# EAGLE design old_control_board (EAGLE 7.7.0)
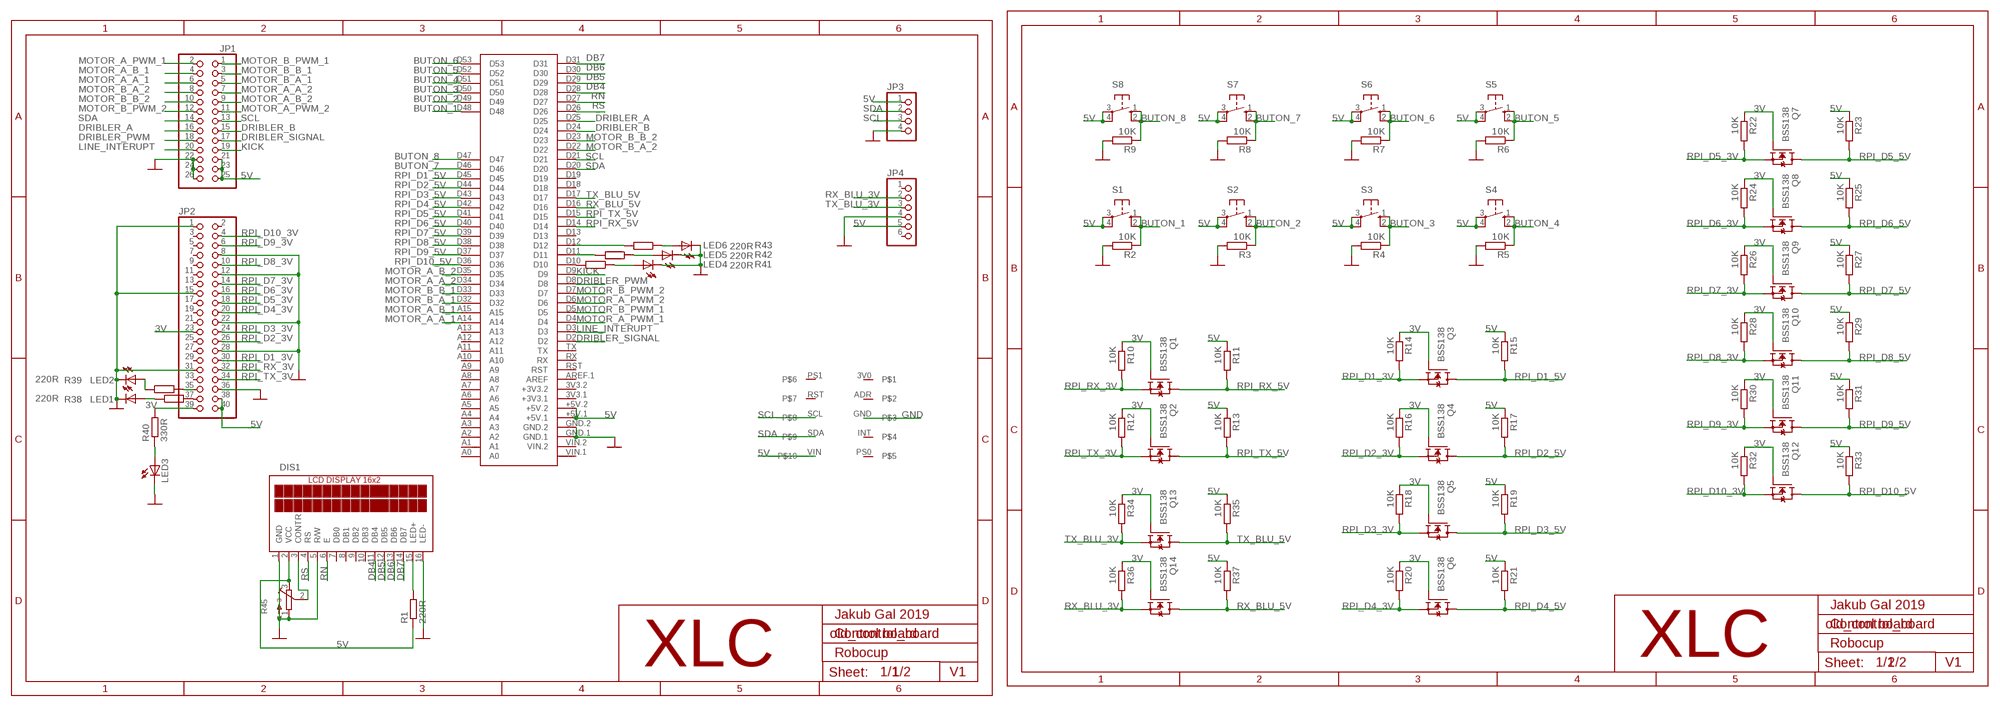
[diagram p0: schematic, sheet 1]

## Parts
DIS1  LCD_DISPLEJ_16X2Z  [LCD_DISPLEJ_16X2]
JP1  PINHD-2X13_2.54  [2X13]
JP2  PINHD-2X20_2.54  [2X20]
JP3  PINHD-1X4_2.54  [1X04]
JP4  PINHD-1X6_2.54  [1X06]
LED1  LEDCHIPLED_0603  [CHIPLED_0603]
LED2  LEDCHIPLED_0603  [CHIPLED_0603]
LED3  LEDCHIPLED_0603  [CHIPLED_0603]
LED4  LEDCHIPLED_0603  [CHIPLED_0603]
LED5  LEDCHIPLED_0603  [CHIPLED_0603]
LED6  LEDCHIPLED_0603  [CHIPLED_0603]
Q1  BSS138  [SOT23]
Q2  BSS138  [SOT23]
Q3  BSS138  [SOT23]
Q4  BSS138  [SOT23]
Q5  BSS138  [SOT23]
Q6  BSS138  [SOT23]
Q7  BSS138  [SOT23]
Q8  BSS138  [SOT23]
Q9  BSS138  [SOT23]
Q10  BSS138  [SOT23]
Q11  BSS138  [SOT23]
Q12  BSS138  [SOT23]
Q13  BSS138  [SOT23]
Q14  BSS138  [SOT23]
R1  220R  R-EU_R0603  [R0603]
R2  10K  R-EU_R0603  [R0603]
R3  10K  R-EU_R0603  [R0603]
R4  10K  R-EU_R0603  [R0603]
R5  10K  R-EU_R0603  [R0603]
R6  10K  R-EU_R0603  [R0603]
R7  10K  R-EU_R0603  [R0603]
R8  10K  R-EU_R0603  [R0603]
R9  10K  R-EU_R0603  [R0603]
R10  10K  R-EU_R0603  [R0603]
R11  10K  R-EU_R0603  [R0603]
R12  10K  R-EU_R0603  [R0603]
R13  10K  R-EU_R0603  [R0603]
R14  10K  R-EU_R0603  [R0603]
R15  10K  R-EU_R0603  [R0603]
R16  10K  R-EU_R0603  [R0603]
R17  10K  R-EU_R0603  [R0603]
R18  10K  R-EU_R0603  [R0603]
R19  10K  R-EU_R0603  [R0603]
R20  10K  R-EU_R0603  [R0603]
R21  10K  R-EU_R0603  [R0603]
R22  10K  R-EU_R0603  [R0603]
R23  10K  R-EU_R0603  [R0603]
R24  10K  R-EU_R0603  [R0603]
R25  10K  R-EU_R0603  [R0603]
R26  10K  R-EU_R0603  [R0603]
R27  10K  R-EU_R0603  [R0603]
R28  10K  R-EU_R0603  [R0603]
R29  10K  R-EU_R0603  [R0603]
R30  10K  R-EU_R0603  [R0603]
R31  10K  R-EU_R0603  [R0603]
R32  10K  R-EU_R0603  [R0603]
R33  10K  R-EU_R0603  [R0603]
R34  10K  R-EU_R0603  [R0603]
R35  10K  R-EU_R0603  [R0603]
R36  10K  R-EU_R0603  [R0603]
R37  10K  R-EU_R0603  [R0603]
R38  220R  R-EU_R0603  [R0603]
R39  220R  R-EU_R0603  [R0603]
R40  330R  R-EU_R0603  [R0603]
R41  220R  R-EU_R0603  [R0603]
R42  220R  R-EU_R0603  [R0603]
R43  220R  R-EU_R0603  [R0603]
R45  3362P  [3362P]
S1  10-XX  [B3F-10XX]
S2  10-XX  [B3F-10XX]
S3  10-XX  [B3F-10XX]
S4  10-XX  [B3F-10XX]
S5  10-XX  [B3F-10XX]
S6  10-XX  [B3F-10XX]
S7  10-XX  [B3F-10XX]
S8  10-XX  [B3F-10XX]
U$1  MEGA2560_MIKRO  [MEGA2560_MIKRO]
U$2  BNO055  [BNO005]

## Nets
3V: JP2.23 JP2.39 Q1.1(G) Q2.1(G) Q3.1(G) Q4.1(G) Q5.1(G) Q6.1(G) Q7.1(G) Q8.1(G) Q9.1(G) Q10.1(G) Q11.1(G) Q12.1(G) Q13.1(G) Q14.1(G) R10.1 R12.1 R14.1 R16.1 R18.1 R20.1 R22.1 R24.1 R26.1 R28.1 R30.1 R32.1 R34.1 R36.1 R40.2
5V: DIS1.2(VCC) JP1.21 JP1.23 JP1.25 JP2.38 JP2.40 JP3.1 JP4.5 R1.1 R11.1 R13.1 R15.1 R17.1 R19.1 R21.1 R23.1 R25.1 R27.1 R29.1 R31.1 R33.1 R35.1 R37.1 R45.3 S1.3(P) S1.4(P1) S2.3(P) S2.4(P1) S3.3(P) S3.4(P1) S4.3(P) S4.4(P1) S5.3(P) S5.4(P1) S6.3(P) S6.4(P1) S7.3(P) S7.4(P1) S8.3(P) S8.4(P1) U$1.+5V.1 U$1.+5V.2 U$2.VIN
BUTON_1: R2.1 S1.1(S) S1.2(S1) U$1.D48
BUTON_2: R3.1 S2.1(S) S2.2(S1) U$1.D49
BUTON_3: R4.1 S3.1(S) S3.2(S1) U$1.D50
BUTON_4: R5.1 S4.1(S) S4.2(S1) U$1.D51
BUTON_5: R6.1 S5.1(S) S5.2(S1) U$1.D52
BUTON_6: R7.1 S6.1(S) S6.2(S1) U$1.D53
BUTON_7: R8.1 S7.1(S) S7.2(S1) U$1.D46
BUTON_8: R9.1 S8.1(S) S8.2(S1) U$1.D47
DB4: DIS1.11(DB4) U$1.D28
DB5: DIS1.12(DB5) U$1.D29
DB6: DIS1.13(DB6) U$1.D30
DB7: DIS1.14(DB7) U$1.D31
DRIBLER_A: JP1.16 U$1.D25
DRIBLER_B: JP1.15 U$1.D24
DRIBLER_PWM: JP1.18 U$1.D8
DRIBLER_SIGNAL: JP1.17 U$1.D2
GND: DIS1.1(GND) DIS1.5(R/W) DIS1.16(LED-) JP1.22 JP1.24 JP1.26 JP2.1 JP2.8 JP2.12 JP2.15 JP2.22 JP2.28 JP2.31 JP2.36 JP3.4 JP4.4 LED1.C LED2.C LED3.C LED4.C LED5.C LED6.C R2.2 R3.2 R4.2 R5.2 R6.2 R7.2 R8.2 R9.2 R45.1 U$1.GND.1 U$1.GND.2 U$2.GND
KICK: JP1.19 U$1.D9
LINE_INTERUPT: JP1.20 U$1.D3
MOTOR_A_A_1: JP1.6 U$1.A14
MOTOR_A_A_2: JP1.7 U$1.D34
MOTOR_A_B_1: JP1.4 U$1.A15
MOTOR_A_B_2: JP1.9 U$1.D35
MOTOR_A_PWM_1: JP1.2 U$1.D4
MOTOR_A_PWM_2: JP1.11 U$1.D6
MOTOR_B_A_1: JP1.5 U$1.D32
MOTOR_B_A_2: JP1.8 U$1.D22
MOTOR_B_B_1: JP1.3 U$1.D33
MOTOR_B_B_2: JP1.10 U$1.D23
MOTOR_B_PWM_1: JP1.1 U$1.D5
MOTOR_B_PWM_2: JP1.12 U$1.D7
N$1: JP2.37 R38.2
N$2: DIS1.15(LED+) R1.2
N$3: DIS1.3(CONTR) R45.2
N$4: LED2.A R39.1
N$5: JP2.35 R39.2
N$6: LED3.A R40.1
N$7: LED4.A R41.1
N$8: R41.2 U$1.D10
N$9: LED5.A R42.1
N$10: R42.2 U$1.D11
N$11: LED6.A R43.1
N$12: R43.2 U$1.D12
N$20: LED1.A R38.1
RN: DIS1.6(E) U$1.D27
RPI_D1_3V: JP2.30 Q3.2(S) R14.2
RPI_D1_5V: Q3.3(D) R15.2 U$1.D45
RPI_D2_3V: JP2.26 Q4.2(S) R16.2
RPI_D2_5V: Q4.3(D) R17.2 U$1.D44
RPI_D3_3V: JP2.24 Q5.2(S) R18.2
RPI_D3_5V: Q5.3(D) R19.2 U$1.D43
RPI_D4_3V: JP2.20 Q6.2(S) R20.2
RPI_D4_5V: Q6.3(D) R21.2 U$1.D42
RPI_D5_3V: JP2.18 Q7.2(S) R22.2
RPI_D5_5V: Q7.3(D) R23.2 U$1.D41
RPI_D6_3V: JP2.16 Q8.2(S) R24.2
RPI_D6_5V: Q8.3(D) R25.2 U$1.D40
RPI_D7_3V: JP2.14 Q9.2(S) R26.2
RPI_D7_5V: Q9.3(D) R27.2 U$1.D39
RPI_D8_3V: JP2.10 Q10.2(S) R28.2
RPI_D8_5V: Q10.3(D) R29.2 U$1.D38
RPI_D9_3V: JP2.6 Q11.2(S) R30.2
RPI_D9_5V: Q11.3(D) R31.2 U$1.D37
RPI_D10_3V: JP2.4 Q12.2(S) R32.2
RPI_D10_5V: Q12.3(D) R33.2 U$1.D36
RPI_RX_3V: JP2.32 Q1.2(S) R10.2
RPI_RX_5V: Q1.3(D) R11.2 U$1.D14
RPI_TX_3V: JP2.34 Q2.2(S) R12.2
RPI_TX_5V: Q2.3(D) R13.2 U$1.D15
RS: DIS1.4(RS) U$1.D26
RX_BLU_3V: JP4.2 Q14.2(S) R36.2
RX_BLU_5V: Q14.3(D) R37.2 U$1.D16
SCL: JP1.13 JP3.3 U$1.D21 U$2.SCL
SDA: JP1.14 JP3.2 U$1.D20 U$2.SDA
TX_BLU_3V: JP4.3 Q13.2(S) R34.2
TX_BLU_5V: Q13.3(D) R35.2 U$1.D17
Unconnected: DIS1.7(DB0) DIS1.8(DB1) DIS1.9(DB2) DIS1.10(DB3) JP2.2 JP2.3 JP2.5 JP2.7 JP2.9 JP2.11 JP2.13 JP2.17 JP2.19 JP2.21 JP2.25 JP2.27 JP2.29 JP2.33 JP4.1 JP4.6 U$1.3V3.1(+3V3.1) U$1.3V3.2(+3V3.2) U$1.A0 U$1.A1 U$1.A2 U$1.A3 U$1.A4 U$1.A5 U$1.A6 U$1.A7 U$1.A8 U$1.A9 U$1.A10 U$1.A11 U$1.A12 U$1.A13 U$1.AREF.1(AREF) U$1.D13 U$1.D18 U$1.D19 U$1.RST U$1.RX U$1.TX U$1.VIN.1 U$1.VIN.2 U$2.3V0 U$2.ADR U$2.INT U$2.PS0 U$2.PS1 U$2.RST

## Notes on the sheet
- Jakub Gal 2019
- Jakub Gal 2019
- Control board
- Control board
- Robocup
- Robocup | XLC
- XLC | 2/2 | V1
- 1/2 | V1

## Library data of the parts
DIS1 = TABOR K1:LCD_DISPLEJ_16X2: LCD displej 16x2 s IO HD44870 : kolik= 0,6x0,6mm diera s pokovenim = 0,9mm vrtanie = 1,1mm
JP1 = pinhead-1:PINHD-2X13: PIN HEADER
JP2 = pinhead-1:PINHD-2X20: PIN HEADER
JP3 = pinhead-1:PINHD-1X4: PIN HEADER
JP4 = pinhead-1:PINHD-1X6: PIN HEADER
LED1-LED6 = audio amplifier example:LED
Q1-Q14 = bss138_10:BSS138: BSS138 N-Channel Logic Level Enhancement Mode Field Effect Transistor Source: http://www.fairchildsemi.com/datasheets/BS/BSS138.pdf; MF: Fairchild; MPN: BSS138; OC_FARNELL: 9845330; OC_NEWARK: 67R2009
R1-R43 = rcl:R-EU_: RESISTOR, European symbol; SPICEPREFIX: R
R45 = bourns:3362: 3362 Series 1/4" Square Trimmer
S1-S8 = switch-omron:10-XX: OMRON SWITCH; MPN: B3F-1000; OC_FARNELL: 176432; OC_NEWARK: 36M3542
U$1 = MIKRO_MEGA2560:MEGA2560_MIKRO: Arduino Mega2560 pro robotDyn, create by mikroavr.com
U$2 = SERVO:BNO055

## Board
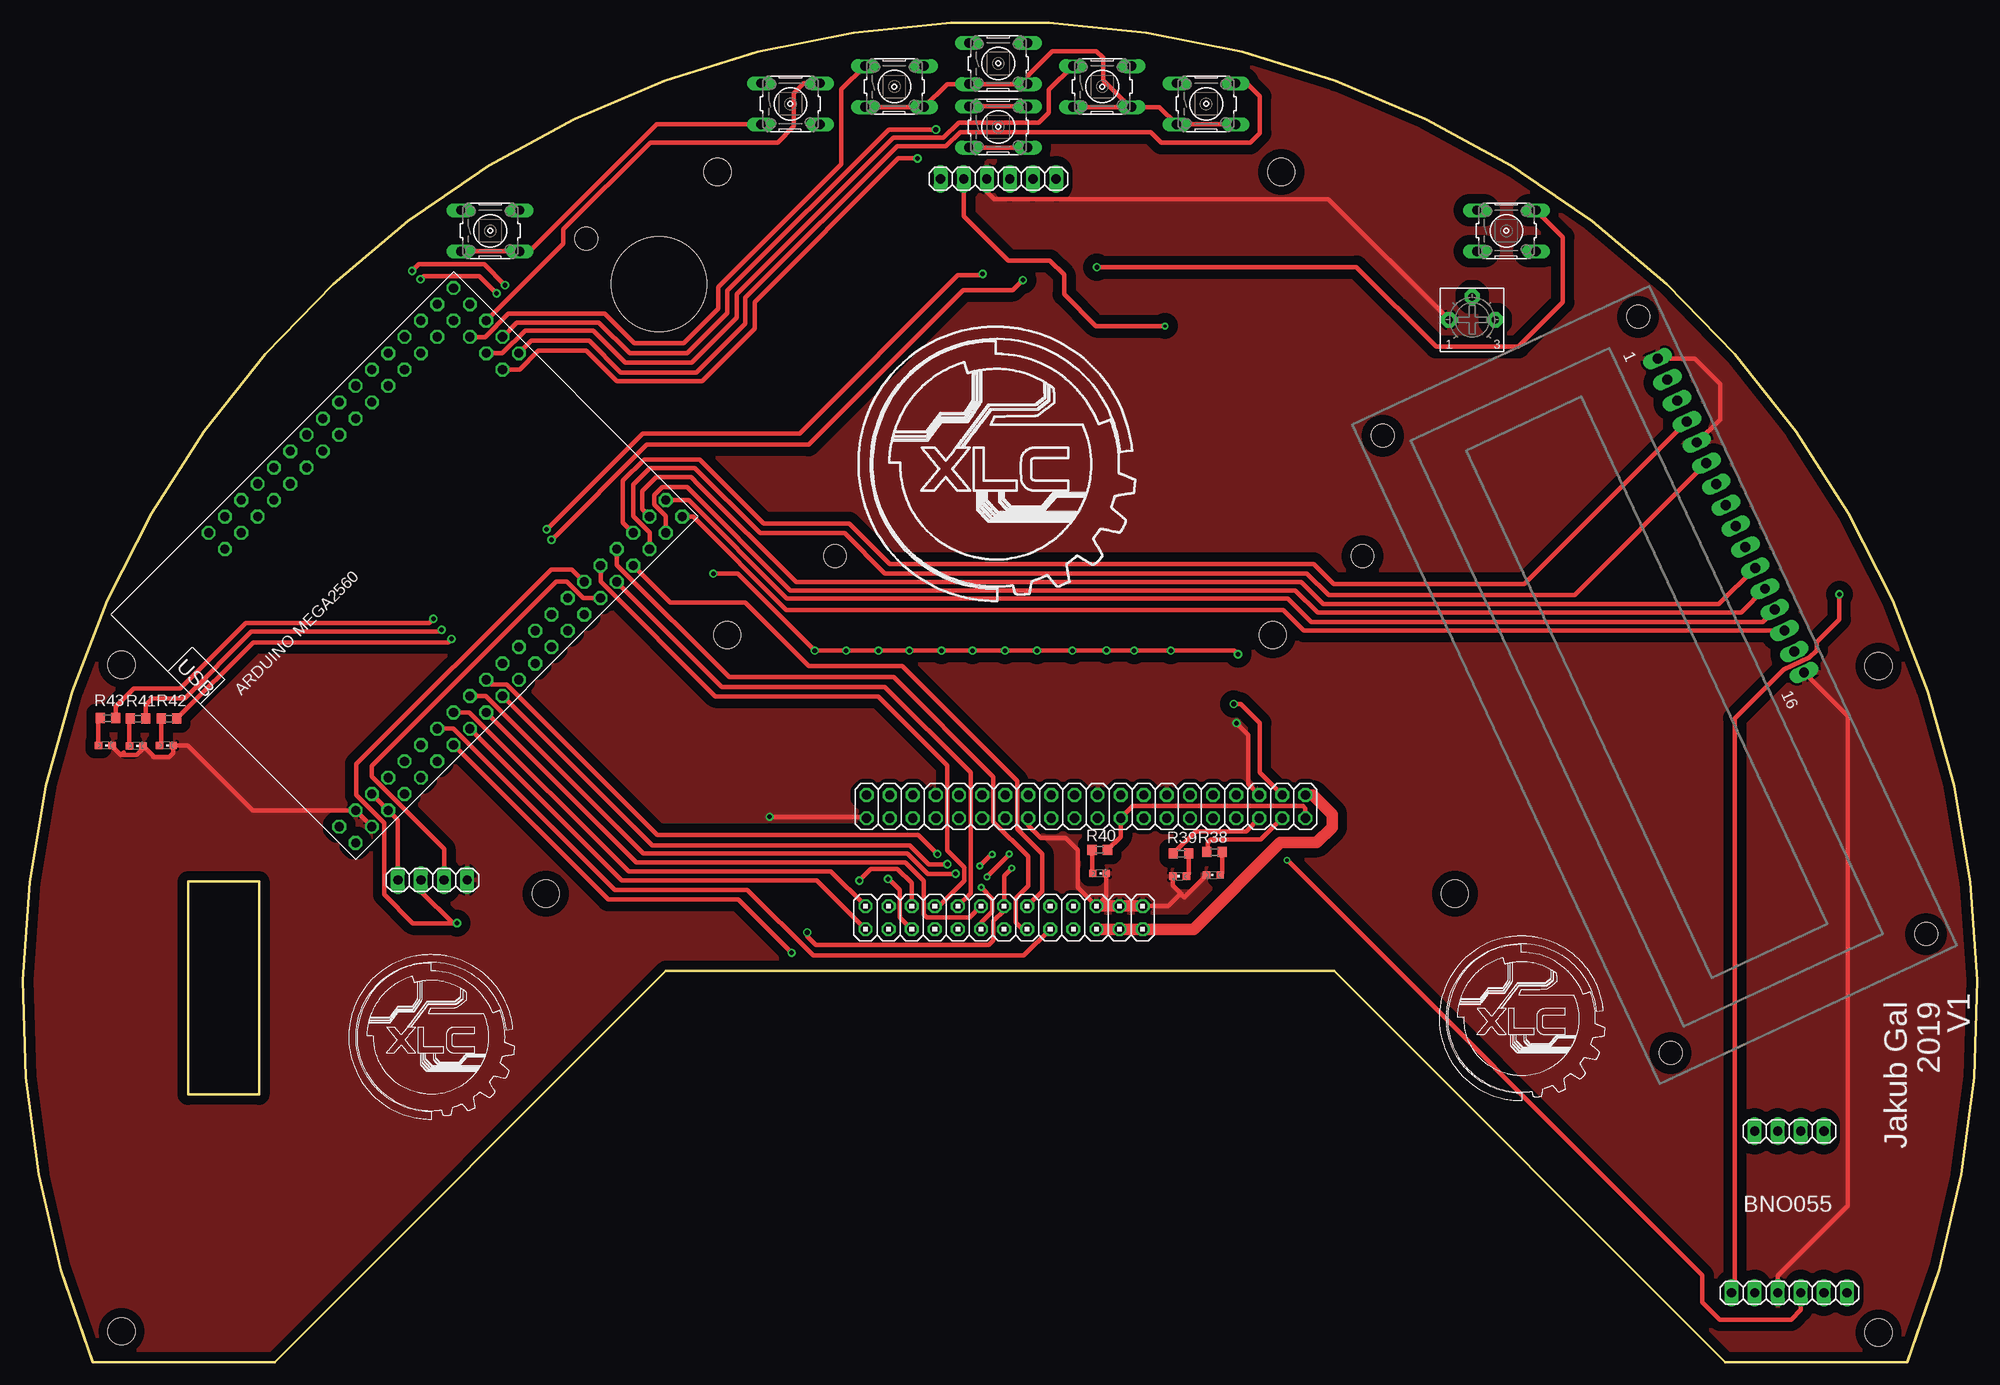
[diagram p1: board, top side]
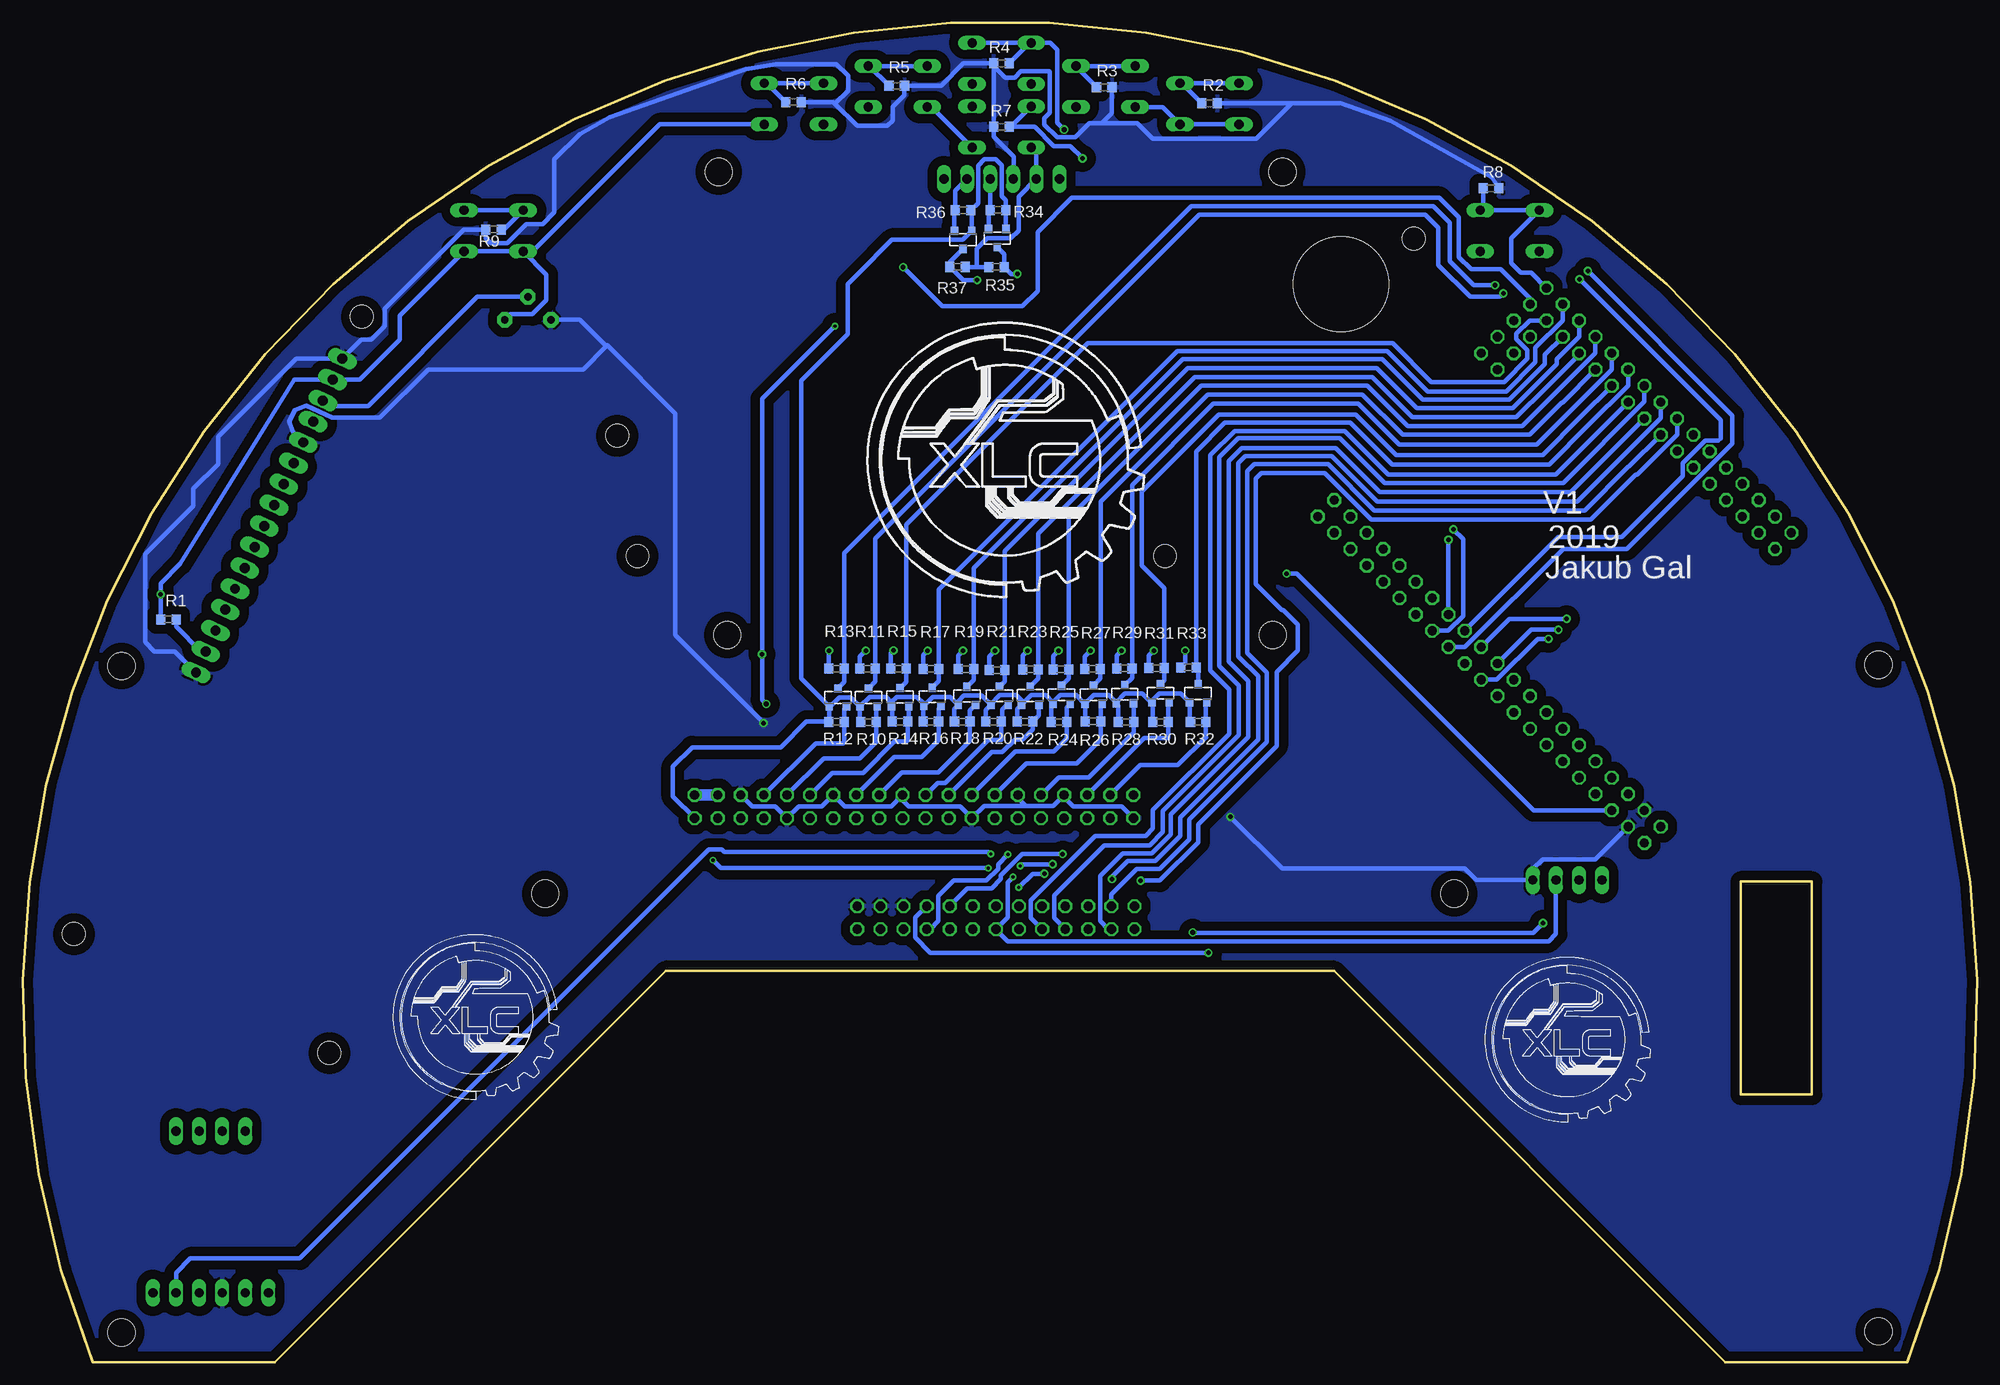
[diagram p2: board, bottom side, seen from below]

Size 214.96 x 147.35 mm. Coordinates in mm from the lower left corner, seen from the top.
Outline: 144.23,43.03 187.27,0 207.27,0 arc224 7.7,0 27.7,0 70.73,43.03 144.23,43.03
Outline: 25.99,29.45 18.19,29.45 18.19,52.85 25.99,52.85 25.99,29.45
Copper layers (1*16): Top 0.035mm / dielectric 1.5mm / Bottom 0.035mm
Design rules "default": minimum track width 6mil, minimum drill 0.35mm, track to track 6mil, track to pad 6mil, pad to pad 6mil, via to via 6mil, smd to smd 6mil, copper to edge 40mil, drill to drill 6mil, minimum pad ring 10mil, minimum via ring 8mil, stop-mask expansion 4mil, vias tented up to drill 0mil, thermal gap 10mil
Holes 3 mm at 10.87,76.72 204.09,76.58 204.09,3.26 10.87,3.4 57.51,51.53 76.41,130.94 137.48,79.99 77.48,79.99 157.51,51.53 138.41,130.94
Holes 2.5 mm at 89.35,88.68 147.35,88.68 61.98,123.6
Holes 10.5 mm at 69.98,118.6

### Footprints (pad centres in the part's own frame; a part is rotated, then mirrored left to right if it is on the bottom)
LCD_DISPLEJ_16X2 = drill 1.092 pad 1.676 long: 1 -33.02,15.24; 2 -30.48,15.24; 3 -27.94,15.24; 4 -25.4,15.24; 5 -22.86,15.24; 6 -20.32,15.24; 7 -17.78,15.24; 8 -15.24,15.24; 9 -12.7,15.24; 10 -10.16,15.24; 11 -7.62,15.24; 12 -5.08,15.24; 13 -2.54,15.24; 14 0,15.24; 15 2.54,15.24; 16 5.08,15.24 | hole 2.54: -38.1,15.24; 36.83,15.24; 36.83,-15.748; -38.1,-15.748
2X13 = drill 1.016 octagon: 1 -15.24,-1.27; 2 -15.24,1.27; 3 -12.7,-1.27; 4 -12.7,1.27; 5 -10.16,-1.27; 6 -10.16,1.27; 7 -7.62,-1.27; 8 -7.62,1.27; 9 -5.08,-1.27; 10 -5.08,1.27; 11 -2.54,-1.27; 12 -2.54,1.27; 13 0,-1.27; 14 0,1.27; 15 2.54,-1.27; 16 2.54,1.27; 17 5.08,-1.27; 18 5.08,1.27; 19 7.62,-1.27; 20 7.62,1.27; 21 10.16,-1.27; 22 10.16,1.27; 23 12.7,-1.27; 24 12.7,1.27; 25 15.24,-1.27; 26 15.24,1.27
2X20 = drill 1.016 octagon: 1 -24.13,-1.27; 2 -24.13,1.27; 3 -21.59,-1.27; 4 -21.59,1.27; 5 -19.05,-1.27; 6 -19.05,1.27; 7 -16.51,-1.27; 8 -16.51,1.27; 9 -13.97,-1.27; 10 -13.97,1.27; 11 -11.43,-1.27; 12 -11.43,1.27; 13 -8.89,-1.27; 14 -8.89,1.27; 15 -6.35,-1.27; 16 -6.35,1.27; 17 -3.81,-1.27; 18 -3.81,1.27; 19 -1.27,-1.27; 20 -1.27,1.27; 21 1.27,-1.27; 22 1.27,1.27; 23 3.81,-1.27; 24 3.81,1.27; 25 6.35,-1.27; 26 6.35,1.27; 27 8.89,-1.27; 28 8.89,1.27; 29 11.43,-1.27; 30 11.43,1.27; 31 13.97,-1.27; 32 13.97,1.27; 33 16.51,-1.27; 34 16.51,1.27; 35 19.05,-1.27; 36 19.05,1.27; 37 21.59,-1.27; 38 21.59,1.27; 39 24.13,-1.27; 40 24.13,1.27
1X04 = drill 1.016 long: 1 -3.81,0; 2 -1.27,0; 3 1.27,0; 4 3.81,0
1X06 = drill 1.016 long: 1 -6.35,0; 2 -3.81,0; 3 -1.27,0; 4 1.27,0; 5 3.81,0; 6 6.35,0
CHIPLED_0603 = smd 0.8 x 0.8: A 0,-0.75; C 0,0.75
SOT23 = smd 0.8 x 0.9: 1 -0.95,-1; 2 0.95,-1; 3 0,1
R0603 = smd 1 x 1.1: 1 -0.85,0; 2 0.85,0
3362P = drill 0.813 pad 1.676 octagon: 1 -2.54,0; 2 0,2.54; 3 2.54,0
B3F-10XX = drill 1.016 long: 1 -3.251,2.261; 2 3.251,2.261; 3 -3.251,-2.261; 4 3.251,-2.261
MEGA2560_MIKRO = drill 1 octagon: 3V3.1 -26.67,-17.78; 3V3.2 -26.67,-20.32; +5V.1 -29.21,-17.78; +5V.2 -29.21,-20.32; A0 -21.59,15.24; A1 -21.59,12.7; A2 -19.05,15.24; A3 -19.05,12.7; A4 -16.51,15.24; A5 -16.51,12.7; A6 -13.97,15.24; A7 -13.97,12.7; A8 -11.43,15.24; A9 -11.43,12.7; A10 -8.89,15.24; A11 -8.89,12.7; A12 -6.35,15.24; A13 -6.35,12.7; A14 -3.81,15.24; A15 -3.81,12.7; AREF.1 -24.13,-17.78; D2 -19.05,-17.78; D3 -19.05,-20.32; D4 -16.51,-17.78; D5 -16.51,-20.32; D6 -13.97,-17.78; D7 -13.97,-20.32; D8 -11.43,-17.78; D9 -11.43,-20.32; D10 -8.89,-17.78; D11 -8.89,-20.32; D12 -6.35,-17.78; D13 -6.35,-20.32; D14 -3.81,-17.78; D15 -3.81,-20.32; D16 -1.27,-17.78; D17 -1.27,-20.32; D18 1.27,-17.78; D19 1.27,-20.32; D20 3.81,-17.78; D21 3.81,-20.32; D22 6.35,-17.78; D23 6.35,-20.32; D24 8.89,-17.78; D25 8.89,-20.32; D26 11.43,-17.78; D27 11.43,-20.32; D28 13.97,-17.78; D29 13.97,-20.32; D30 16.51,-17.78; D31 16.51,-20.32; D32 -1.27,15.24; D33 -1.27,12.7; D34 1.27,15.24; D35 1.27,12.7; D36 3.81,15.24; D37 3.81,12.7; D38 6.35,15.24; D39 6.35,12.7; D40 8.89,15.24; D41 8.89,12.7; D42 11.43,15.24; D43 11.43,12.7; D44 13.97,15.24; D45 13.97,12.7; D46 16.51,15.24; D47 16.51,12.7; D48 16.51,10.16; D49 13.97,10.16; D50 16.51,7.62; D51 13.97,7.62; D52 16.51,5.08; D53 13.97,5.08; GND.1 -31.75,-17.78; GND.2 -31.75,-20.32; RST -24.13,-20.32; RX -21.59,-17.78; TX -21.59,-20.32; VIN.1 -34.29,-17.78; VIN.2 -34.29,-20.32
BNO005 = drill 1.016 long: 3V0 -3.81,-17.78; ADR 3.81,0; GND -1.27,-17.78; INT 1.27,0; PS0 -3.81,0; PS1 -1.27,0; RST 6.35,-17.78; SCL 3.81,-17.78; SDA 1.27,-17.78; VIN -6.35,-17.78

### Placement (x,y rotation side)
DIS1  179.95,74.03 295 top
JP1  107.93,48.9 0 top
JP2  116.94,61.11 0 top
JP3  45.07,53.03 0 top
JP4  107.3,130.18 180 top
LED1  130.95,53.59 90 top
LED2  127.25,53.45 90 top
LED3  118.43,53.77 270 top
LED4  12.49,67.78 270 top
LED5  15.8,67.83 270 top
LED6  9.08,67.84 270 top
Q1  121.94,73.12 0 bottom
Q2  125.31,73.12 0 bottom
Q3  118.46,73.16 0 bottom
Q4  114.93,73.2 0 bottom
Q5  111.13,73.3 0 bottom
Q6  107.53,73.32 0 bottom
Q7  104.16,73.33 0 bottom
Q8  100.71,73.42 0 bottom
Q9  97.2,73.43 0 bottom
Q10  93.76,73.48 0 bottom
Q11  89.83,73.58 0 bottom
Q12  85.69,73.57 0 bottom
Q13  107.78,123.66 180 bottom
Q14  111.54,123.47 180 bottom
R1  198.95,81.7 0 bottom
R2  84.44,138.47 0 bottom
R3  96.02,140.25 0 bottom
R4  107.3,142.88 180 bottom
R5  118.84,140.42 0 bottom
R6  130.21,138.62 0 bottom
R7  107.3,135.89 180 bottom
R8  53.49,129.13 0 bottom
R9  163.18,124.61 180 bottom
R10  121.93,70.4 0 bottom
R11  122.04,76.29 0 bottom
R12  125.44,70.43 0 bottom
R13  125.45,76.3 0 bottom
R14  118.48,70.46 0 bottom
R15  118.64,76.29 0 bottom
R16  115.09,70.47 0 bottom
R17  115.07,76.26 0 bottom
R18  111.63,70.47 0 bottom
R19  111.23,76.24 0 bottom
R20  108.18,70.45 0 bottom
R21  107.82,76.12 0 bottom
R22  104.72,70.45 0 bottom
R23  104.14,76.2 0 bottom
R24  100.99,70.42 0 bottom
R25  100.79,76.2 0 bottom
R26  97.27,70.48 0 bottom
R27  97.29,76.26 0 bottom
R28  93.61,70.42 0 bottom
R29  93.81,76.32 0 bottom
R30  89.82,70.4 0 bottom
R31  90.25,76.34 0 bottom
R32  85.68,70.44 0 bottom
R33  86.76,76.42 0 bottom
R34  107.7,126.75 180 bottom
R35  107.88,120.47 0 bottom
R36  111.54,126.71 180 bottom
R37  112.14,120.49 180 bottom
R38  131.09,56.12 180 top
R39  127.4,55.95 180 top
R40  118.45,56.35 0 top
R41  12.68,70.8 0 top
R42  16.08,70.79 0 top
R43  9.36,70.84 0 top
R45  159.41,114.66 0 top
S1  84.44,138.43 0 top
S2  95.87,140.34 0 top
S3  107.3,142.88 0 top
S4  118.73,140.34 0 top
S5  130.16,138.43 0 top
S6  107.3,135.89 0 top
S7  51.42,124.46 0 top
S8  163.18,124.46 0 top
U$1  46.48,95.72 45 top
U$2  194.29,25.4 0 top

### Tracks (layer width: path | path; a pad name or v marks a point on that pad's centre or on a via)
3V
  Top 0.508: R40.2 120.75,57.8 JP2.23 122.08,61.17 140.82,61.17 141.07,60.92 JP2.39
  Bottom 0.508: Q3.1 119.41,72.6 118.82,73.19 116.64,73.19 115.88,72.43 Q4.1 | 126.26,72.01 Q2.1 | Q4.1 114.89,73.19 112.97,73.19 Q5.1 | R16.1 115.94,72.13 Q4.1 | Q5.1 112.51,71.87 112.51,70.5 R18.1 | R20.1 109.03,71.76 Q6.1 108.5,72.34 | 108.5,72.34 109.49,73.33 111.45,73.33 112.08,72.7 Q5.1 | Q7.1 105.11,72.77 105.71,73.37 107.48,73.37 108.5,72.34 | Q7.1 105.57,71.86 R22.1 | 101.66,72.57 Q8.1 101.84,72.23 R24.1 | 101.66,72.57 102.46,73.38 104.06,73.38 Q7.1 | Q9.1 98.12,72.4 R26.1 | Q9.1 99.1,73.38 100.85,73.38 101.66,72.57 | R28.1 94.46,72.23 Q10.1 94.71,72.57 | 94.71,72.57 95.52,73.39 97.19,73.39 Q9.1 | R30.1 90.67,72.47 Q11.1 90.85,72.58 | 90.85,72.58 91.81,73.54 93.74,73.54 94.71,72.57 | 90.85,72.58 90.85,72.7 89.99,73.56 87.63,73.56 Q12.1 86.64,70.55 R32.1 | Q13.1 106.85,124.67 R34.1 106.85,127.81 107.3,128.26 107.3,131.69 107.93,132.32 109.22,132.32 109.89,131.65 109.89,127.5 R36.1 | R36.1 110.59,126.61 Q14.1 111.6,123.47 119.37,123.47 123.06,119.78 124.25,118.59 124.25,113.09 129.36,107.98 129.36,75.22 Q2.1 | R36.1 | R14.1 119.33,72.08 Q3.1 | Q3.1 119.41,72.59 120.01,73.18 121.82,73.18 Q1.1 | Q1.1 123.9,73.13 125.14,73.13 126.26,72.01 | 126.26,72.01 126.26,72 | Q1.1 122.89,70.5 R10.1 | Q2.1 126.26,70.46 | 126.26,70.46 R12.1 | JP2.39 143.46,62.23 143.46,65.52 141.35,67.62 131.61,67.62 128.78,70.46 126.26,70.46
5V  (via drill 0.35, 0.5)
  Top 0.508: S2.3 S2.4 101.66,140.61 S3.3 S3.4 110.55,141.55 113.24,144.24 118.08,144.24 118.82,143.5 118.82,141.04 121.79,138.07 S4.4 | S4.3 S4.4 | S4.4 125,138.07 S5.3 S5.4 | S7.3 S7.4 55.77,122.2 69.74,136.17 S1.3 | U$2.VIN 188.28,7.96 188.28,70.81 193.66,76.2 196.49,77.52 197.28,78.31 197.28,79.2 199.8,81.72 v199.8,84.46 | v133.64,77.88 133.24,78.28 v126.27,78.28 v122.23,78.28 122.21,78.3 v119.19,78.3 115.46,78.3 v115.43,78.28 v111.54,78.28 v108.03,78.28 v104.46,78.28 v101.04,78.28 v97.5,78.28 v94.11,78.28 v90.56,78.28 v87.11,78.28 78.64,86.75 v75.95,86.75 | JP2.38 136.06,64.85 136.06,70.28 133.94,72.4 v133.19,72.4 | S6.4 S6.3 | U$1.+5V.1 U$1.+5V.2 41.26,59.64 JP3.1 | JP4.5 103.49,126.05 108.36,121.17 112.97,121.17 114.52,119.62 114.52,117.48 118.01,113.99 v125.63,113.99
  Top 1.27: JP1.21 JP1.23 JP1.25 128.79,47.62 138.33,57.17 142.34,57.17 144.01,58.84 144.01,60.27 141.9,62.38 JP2.40
  Bottom 0.508: 101.39,76.45 R25.1 101.64,77.67 v101.04,78.28 | R37.1 111.27,120.47 110.03,120.47 | 110.03,120.47 R35.1 | S6.3 103.49,133.07 JP4.5 105.44,128.22 105.44,124.5 106.28,123.66 108.88,123.66 110.03,122.51 110.03,120.47 | S6.4 114.99,138.07 S4.3 | S1.3 S1.4 89.59,138.07 S2.3 | S5.4 144.91,136.17 158.88,122.2 S8.3 | S8.3 S8.4 173.48,115.15 173.48,112.5 177.88,108.1 DIS1.2 185.12,108.1 197.62,87.83 199.8,85.65 v199.8,84.46 R1.1 | v133.19,72.4 133.64,72.86 v133.64,77.88 133.64,105.98 v125.63,113.99 | R33.1 87.11,76.93 v87.11,78.28 | R31.1 91.1,77.74 v90.56,78.28 | R29.1 94.66,77.73 v94.11,78.28 | R27.1 98.14,77.64 v97.5,78.28 | R23.1 104.99,77.75 v104.46,78.28 | R21.1 108.67,77.64 v108.03,78.28 | R19.1 112.08,77.74 v111.54,78.28 | R17.1 115.92,77.79 v115.43,78.28 | R15.1 119.49,78 v119.19,78.3 | R11.1 122.89,77.62 v122.23,78.28 | S8.3 157.38,119.65 157.38,116.82 158.91,115.29 161.32,115.29 R45.3 | R13.1 126.3,78.25 v126.27,78.28 | U$1.+5V.2 48.79,60.7 74.83,86.75 v75.95,86.75
  Bottom 1.27: JP2.40 JP2.38
BUTON_1
  Top 0.508: U$1.D48 59.46,123.07 59.46,124.64 68.99,134.18 83.02,134.18 84.82,135.97 84.82,139.61 85.89,140.69 S1.2
  Bottom 0.508: S1.1 S1.2 87.5,140.69 R2.1
BUTON_2
  Top 0.508: U$1.D49 50.87,112.79 53.41,115.32 64.03,115.32 67.28,112.08 72.68,112.08 76.5,115.9 76.5,118.24 90.03,131.77 90.03,140.01 S2.1
  Bottom 0.508: R3.1 99.12,142.5 S2.2 S2.1
BUTON_3  (via drill 0.55)
  Top 0.508: U$1.D50 54.35,114.37 63.37,114.37 66.74,111 73.1,111 77.49,115.39 77.49,117.87 95.22,135.6 v100.44,135.6
  Bottom 0.508: S3.1 S3.2 | R4.1 104.18,145.14 S3.1 | S3.1 101.95,145.14 101.17,144.36 101.17,136.34 v100.44,135.6
BUTON_4
  Top 0.508: U$1.D51 52.76,110.99 55.26,113.49 62.73,113.49 66.26,109.96 73.57,109.96 78.52,114.92 78.52,117.49 95.75,134.71 101.26,134.71 102.93,136.38 111.77,136.38 112.84,137.45 112.84,139.96 S4.1
  Bottom 0.508: S4.1 S4.2 121.86,142.6 R5.1
BUTON_5
  Top 0.508: U$1.D52 55.94,112.37 62.29,112.37 65.77,108.89 74.1,108.89 79.49,114.28 79.49,117.08 96.15,133.75 101.53,133.75 103.1,135.31 124.04,135.31 125.22,134.13 135,134.13 136.07,135.2 136.07,139.25 134.63,140.69 S5.2
  Bottom 0.508: S5.1 S5.2 133.12,140.69 R6.1
BUTON_6  (via drill 0.5)
  Top 0.508: S6.1 S6.2 | U$1.D53 54.65,109.19 56.72,111.27 61.95,111.27 65.31,107.91 74.73,107.91 80.5,113.68 80.5,116.61 96.32,132.43 v98.4,132.43
  Bottom 0.508: S6.1 106.3,135.89 | 106.3,135.89 R7.1 | v98.4,132.43 99.75,133.78 101.55,133.78 103.66,135.89 106.3,135.89
BUTON_7
  Bottom 0.508: R8.1 54.34,127.05 S7.2 S7.1 51.24,123.65 51.24,120.91 50.2,119.87 49.08,119.87 U$1.D46
BUTON_8  (via drill 0.5)
  Top 0.508: v118.13,120.47 146.68,120.47 155.44,111.71 164.49,111.71 169.37,116.59 169.37,123.77 S8.2
  Bottom 0.508: R9.1 162.04,124.61 S8.1 S8.2 | U$1.D47 49.18,117.02 52.38,120.22 55.64,120.22 57,121.58 57,125.96 59.15,128.11 99.57,128.11 103.34,124.33 103.34,117.84 105.01,116.17 113.84,116.17 v118.13,120.47
DB4
  Top 0.508: U$1.D28 68.12,93.84 68.12,95.81 69.68,97.38 73.5,97.38 74.31,96.56 85.08,85.8 140.6,85.8 143,83.39 186.55,83.39 DIS1.11
DB5
  Top 0.508: U$1.D29 70.73,93.07 69.43,94.36 69.43,95.37 70.31,96.25 73.09,96.25 84.43,84.91 139.97,84.91 142.44,82.44 188.98,82.44 DIS1.12
DB6
  Top 0.508: U$1.D30 73.22,94.83 84.05,83.99 139.15,83.99 141.7,81.44 191.35,81.44 DIS1.13
DB7
  Top 0.508: DIS1.14 140.91,80.47 138.63,82.76 83.97,82.76 73.72,93.01 72.55,93.01 U$1.D31
DRIBLER_A
  Top 0.508: U$1.D25 71.19,83.59 79.45,83.59 86.46,76.57 96.71,76.57 109.36,63.93 109.36,58.66 112.11,55.91 112.11,51.8 JP1.16
DRIBLER_B
  Top 0.508: U$1.D24 65.34,87.7 77.68,75.35 95.79,75.35 106.76,64.38 106.76,59.43 110.57,55.63 110.57,52.38 109.19,51.01 109.19,48.39 109.96,47.62 JP1.15
DRIBLER_PWM  (via drill 0.5)
  Top 0.508: v100.59,55.89 98.51,57.98 69.77,57.98 53.21,74.54 51.5,74.54 U$1.D8
  Bottom 0.508: JP1.18 111.06,52.12 108.41,52.12 107.38,53.15 107.38,53.55 105.05,55.89 v100.59,55.89
DRIBLER_SIGNAL
  Top 0.508: U$1.D2 47.38,69.68 65.09,51.97 79.7,51.97 86.93,44.73 110.12,44.73 JP1.17
GND  (via drill 0.5)
  Top 0.508: DIS1.1 183.88,110.4 186.68,107.6 186.68,103.7 184.17,101.19 DIS1.5 | LED1.C 127.76,51.15 127.25,51.65 127.26,51.66 | JP1.26 125.99,50.16 127.37,51.55 127.26,51.66 | LED2.C 126.5,52.42 127.26,51.66 | LED6.C 9.83,67.74 10.78,66.78 | 10.78,66.78 12.53,66.78 13.24,67.49 LED4.C 14.36,66.66 14.36,66.58 16.09,66.58 16.55,67.04 LED5.C 18.15,67.83 25.28,60.7 U$1.GND.1 U$1.GND.2 38.25,58.76 | JP4.4 106.03,128.76 106.83,127.96 143.57,127.96 R45.1 | DIS1.16 200.72,71.06 200.72,36.54 200.73,36.53 200.73,17.19 193.02,9.48 U$2.GND | 10.78,66.78 11.08,67.08 | v133.48,70.3 134.77,69.01 134.77,63.6 JP2.36 | LED3.C 119.18,51.25 JP1.22 116.05,52.2 116.05,56.32 114.73,57.65 111.96,57.65 110.59,59.02 JP2.15 | v82.15,59.98 92.67,59.98 JP2.1
  Top 1.27: JP1.22 JP1.24 JP1.26
  Bottom 0.508: 105.95,129.67 105.95,132.63 108.15,134.82 R7.2 R4.2 | R4.2 111.51,142.88 113.96,140.42 R5.2 117.99,139.4 119.28,138.1 119.28,136.6 119.88,136 123.18,136 125.63,138.45 | R4.2 108.15,142.56 106.88,141.3 105.88,141.3 105.18,142 102.09,142 102,141.91 102,137.44 102.61,136.84 102.61,136.15 101.21,134.75 99.2,134.75 97.65,136.3 96.28,136.3 | R3.2 95.17,137.41 96.28,136.3 | R6.2 125.81,138.62 125.63,138.45 | R8.2 53.37,130.31 64.55,136.55 70,138.47 75.41,138.47 | 75.41,138.47 R2.2 | 96.28,136.3 92.38,136.3 90.68,134.6 79.28,134.6 75.41,138.47 | 125.63,138.45 124.18,139.9 124.18,141.5 125.48,142.8 132.13,142.8 135.45,142.23 150.39,136.96 153.72,135.1 156.48,132.34 156.48,126.5 157.78,125.2 159.58,125.2 161.68,123.1 163.48,123.1 164.03,123.64 R9.2 166.44,124.61 175.12,115.92 175.12,113.95 176.61,112.46 177.74,112.46 DIS1.1 184.88,110.4 193.48,101.8 193.48,98.8 196.18,96.1 196.18,94.2 201.48,88.9 201.48,79.2 200.48,78.2 198.24,78.2 DIS1.16 | DIS1.5 185.28,102.37 185.67,103.45 185.06,104.76 183.75,105.23 180.89,103.9 175.68,103.9 170.38,109.2 153.34,109.2 150.79,111.75 | v133.48,70.3 143.17,79.99 143.17,104.37 150.67,111.87 150.79,111.75 | 150.79,111.75 153.69,114.66 R45.1 | JP2.1 94.08,61.11 99.43,61.11 100.43,62.1 JP2.8 101.61,61.2 104.64,61.2 | 104.64,61.2 105.51,62.08 JP2.12 | 104.64,61.2 109.23,61.2 JP2.15 111.87,61.12 117.51,61.12 118.21,61.82 JP2.22 119.46,61.13 124.58,61.13 JP2.28 127.1,61.12 129.64,61.12 JP2.31 132.18,61.11 134.72,61.11 JP2.36 | U$1.GND.2 41.99,55.31 47.81,55.31 48.88,54.24 JP3.4 55.09,53.03 56.36,54.3 76.46,54.3 v82.15,59.98
  pour Bottom (isolate 1.016): -5.02,-8 222.98,-8 222.98,151 -5.02,151
  pour Top (isolate 1.016): -7.02,-9 223.98,-9 223.98,152 -7.02,152
KICK  (via drill 0.35, 0.5)
  Top 0.508: U$1.D9 69.22,56.82 97.58,56.82 99.62,54.77 v101.69,54.77 | v105.24,54.58 106.52,55.86 v106.61,55.86
  Bottom 0.508: v101.69,54.77 105.06,54.77 v105.24,54.58 | v106.61,55.86 107.7,54.77 107.7,54.27 108.97,52.99 112.57,52.99 114.29,51.28 114.29,48.51 115.17,47.62 JP1.19
LINE_INTERUPT  (via drill 0.5)
  Top 0.508: U$1.D3 64.39,50.88 78.71,50.88 v84.57,45.02
  Bottom 0.508: v84.57,45.02 115.13,45.02 116.81,46.7 116.81,48.91 JP1.20
MOTOR_A_A_1  (via drill 0.5)
  Top 0.508: JP1.6 97.77,52.69 96.2,54.26 93.29,54.26 v92.01,52.97
  Bottom 0.508: U$1.A14 33.01,102.03 37.42,97.63 | 37.42,97.62 37.42,97.63 | 37.42,97.63 37.58,97.63 42.5,92.7 66.65,92.7 71.75,97.8 78.76,97.8 79.37,97.2 79.37,85.62 76.51,82.76 76.33,82.76 74.71,81.14 74.71,78.27 77.06,75.93 77.06,67.76 85.67,59.14 85.67,57.19 89.89,52.97 v92.01,52.97
MOTOR_A_A_2
  Bottom 0.508: U$1.D34 36.6,105.64 45.56,96.69 65.17,96.69 70.12,101.64 81.28,101.64 83.36,99.56 83.36,76.58 81.21,74.43 81.21,68.99 89.56,60.64 89.56,58.32 91.02,56.86 95.99,56.86 101.53,51.31 101.53,48.85 JP1.7
MOTOR_A_B_1
  Bottom 0.508: U$1.A15 38.32,98.5 38.39,98.5 43.19,93.69 66.31,93.69 71.4,98.78 79.53,98.78 80.27,98.04 80.27,78.03 78.12,75.88 78.12,68.22 86.64,59.7 86.64,57.52 89.92,54.23 92.46,54.23 95.23,51.46 JP1.4
MOTOR_A_B_2
  Bottom 0.508: U$1.D35 46.35,97.66 64.8,97.66 69.59,102.45 81.68,102.45 84.36,99.76 84.36,76.07 82.28,73.99 82.28,69.12 90.66,60.75 90.66,58.69 91.45,57.9 96.99,57.9 104.1,50.79 104.1,48.87 JP1.9
MOTOR_A_PWM_1
  Top 0.508: U$1.D4 49.13,71.48 66.63,53.98 88.88,53.98 JP1.2
MOTOR_A_PWM_2  (via drill 0.35, 0.5)
  Top 0.508: U$1.D6 50.95,73.27 68.25,55.97 97.3,55.97 99.55,53.73 v102.6,53.73 | v105.41,52.2 106.63,50.98 106.63,49.57 105.41,48.35 105.41,47.64 JP1.11
  Bottom 0.508: v102.6,53.73 103.89,53.73 v105.41,52.2
MOTOR_B_A_1  (via drill 0.5)
  Top 0.508: v95.17,53.14 95.26,53.14 96.47,51.93 96.47,48.93 JP1.5
  Bottom 0.508: U$1.D32 34.81,103.87 44.01,94.67 65.99,94.67 71,99.67 80.5,99.67 81.27,98.9 81.27,77.65 79.1,75.48 79.1,68.49 87.67,59.92 87.67,57.88 90.42,55.13 93.44,55.13 95.17,53.4 v95.17,53.14
MOTOR_B_A_2
  Top 0.508: U$1.D22 63.54,85.87 76.18,73.23 94.12,73.23 101.7,65.66 101.7,56.27 103.57,54.4 103.57,52.95 100.78,50.16 JP1.8
MOTOR_B_B_1
  Bottom 0.508: U$1.D33 40.12,100.29 | 40.12,100.29 | 40.12,100.29 44.69,95.72 65.71,95.72 70.56,100.58 80.89,100.58 82.33,99.13 82.33,77.08 80.16,74.91 80.16,68.78 88.69,60.25 88.69,58.05 90.78,55.97 94,55.97 96.46,53.51 96.46,48.53 95.55,47.62 JP1.3
MOTOR_B_B_2
  Top 0.508: U$1.D23 76.9,74.29 94.81,74.29 104.24,64.87 104.24,51.55 JP1.10
MOTOR_B_PWM_1
  Top 0.508: U$1.D5 65.87,52.99 87.33,52.99 JP1.1
MOTOR_B_PWM_2
  Top 0.508: U$1.D7 67.46,54.99 97.04,54.99 99.09,52.94 99.09,49.25 99.41,48.93 104.16,48.93 JP1.12
N$1
  Top 0.508: JP2.37 136.16,57.48 130.68,57.48 130.31,57.1 130.31,56.19 R38.2
N$2
  Bottom 0.508: R1.2 198.1,80.9 195.37,78.17 DIS1.15
N$3
  Bottom 0.508: DIS1.3 181.36,105.2 176.98,105.2 164.98,117.2 R45.2
N$4
  Top 0.508: R39.1 128.25,53.7 LED2.A
N$5
  Top 0.508: JP2.35 134.54,58.39 128.99,58.39 R39.2
N$6
  Top 0.508: R40.1 117.6,53.84 LED3.A
N$7
  Top 0.508: 11.85,70.79 R41.1 11.74,70.71 LED4.A
N$8  (via drill 0.5)
  Top 0.508: v46.08,80.57 45.89,80.38 25.15,80.38 17.8,73.03 14.27,73.03 13.53,72.3 R41.2
  Bottom 0.508: U$1.D10 49.06,80.57 v46.08,80.57
N$9
  Top 0.508: R42.1 15.23,68.02 LED5.A
N$10  (via drill 0.5)
  Top 0.508: R42.2 25.33,79.19 46.8,79.19 v47.16,79.55
  Bottom 0.508: v47.16,79.55 48.36,79.55 52.85,75.07 U$1.D11
N$11
  Top 0.508: 8.3,67.87 LED6.A 8.33,70.66 R43.1
N$12  (via drill 0.5)
  Top 0.508: R43.2 10.21,72.11 12.22,74.12 17.33,74.12 24.53,81.32 44.72,81.32 v45.16,81.77
  Bottom 0.508: v45.16,81.77 51.46,81.77 U$1.D12
N$20
  Top 0.508: R38.1 131.94,53.83 LED1.A
RN
  Top 0.508: U$1.D27 68.93,91.24 67.12,93.05 67.12,96.53 68.96,98.37 73.91,98.37 81.09,91.2 90.39,91.2 94.81,86.78 141.23,86.78 143.61,84.4 170.68,84.4 DIS1.6
RPI_D1_3V
  Bottom 0.508: 117.58,72.1 Q3.2 117.51,70.57 R14.2 117.63,68.4 117.76,68.26 119.09,68.26 122.53,64.82 125.93,64.82 JP2.30
RPI_D1_5V
  Bottom 0.508: Q3.3 117.79,74.84 R15.2 117.79,92.12 97.83,112.08 64.29,112.08 60.05,107.84 52.04,107.84 49.48,110.39 49.48,111.32 50.69,112.52 50.69,113.13 49.23,114.58 U$1.D45
RPI_D2_3V
  Bottom 0.508: Q4.2 114.24,71.93 R16.2 114.24,68.43 116.11,66.56 119.11,66.56 JP2.26
RPI_D2_5V
  Bottom 0.508: Q4.3 114.21,74.91 R17.2 114.22,84.98 87.97,111.23 64.89,111.23 60.45,106.8 51.82,106.8 48.59,110.02 48.59,111.58 45.58,114.59 U$1.D44
RPI_D3_3V
  Bottom 0.508: Q5.2 110.8,71.68 110.8,70.49 R18.2 110.78,68.35 114.28,64.85 118.28,64.85 JP2.24
RPI_D3_5V
  Bottom 0.508: Q5.3 110.38,75.04 R19.2 110.38,87.35 87.39,110.34 65.44,110.34 60.97,105.88 51.45,105.88 47.54,109.79 47.54,110.83 U$1.D43
RPI_D4_3V
  Bottom 0.508: Q6.2 106.77,72.32 107.26,71.82 107.26,70.52 R20.2 107.33,68.46 107.37,68.42 108.78,68.42 113.48,63.72 114.33,63.72 JP2.20
RPI_D4_5V
  Bottom 0.508: Q6.3 106.97,74.87 R21.2 106.97,89.2 86.84,109.34 66.02,109.34 61.66,104.97 51.08,104.97 46.25,109.8 46.25,110.34 43.79,112.8 U$1.D42
RPI_D5_3V
  Bottom 0.508: Q7.2 103.21,71.12 R22.2 103.87,69.59 104.97,68.49 105.82,68.49 107.21,67.1 108.41,67.1 JP2.18
RPI_D5_5V
  Bottom 0.508: Q7.3 103.29,75.19 R23.2 103.29,91.16 86.08,108.37 66.56,108.37 62.16,103.97 50.68,103.97 47.42,107.23 47.41,107.23 43.79,110.84 U$1.D41
RPI_D6_3V
  Bottom 0.508: Q8.2 100.14,72.03 R24.2 100.14,68.59 101.56,67.17 105.8,67.17 JP2.16
RPI_D6_5V
  Bottom 0.508: Q8.3 99.94,75.18 R25.2 99.94,92.86 85.37,107.43 67.1,107.43 62.65,102.99 50.04,102.99 46.64,106.38 46.61,106.38 | U$1.D40 41.99,111 46.61,106.38 | 46.61,106.37 46.61,106.38
RPI_D7_3V
  Bottom 0.508: Q9.2 96.42,72.25 R26.2 96.42,68.5 96.41,68.49 99.03,65.86 104.57,65.86 JP2.14
RPI_D7_5V
  Bottom 0.508: Q9.3 96.44,75.18 R27.2 96.43,76.28 96.43,94.69 84.65,106.46 67.66,106.46 63.21,102.02 49.24,102.02 45.68,105.57 45.61,105.57 | U$1.D39 45.61,105.57 | 45.61,105.56 45.61,105.57
RPI_D8_3V
  Bottom 0.508: Q10.2 92.76,72.43 R28.2 92.76,69.27 97.71,64.32 101.03,64.32 JP2.10
RPI_D8_5V
  Bottom 0.508: Q10.3 92.96,75.27 R29.2 92.96,96.5 84.02,105.44 68.06,105.44 63.56,100.94 48.47,100.94 40.2,109.21 U$1.D38
RPI_D9_3V
  Bottom 0.508: Q11.2 88.97,72.48 R30.2 88.97,68.69 88.96,68.68 91.59,68.68 JP2.6
RPI_D9_5V
  Bottom 0.508: Q11.3 89.4,75 R31.2 89.4,85.17 91.87,87.63 91.87,95.77 83.4,104.24 68.35,104.24 63.92,99.81 47.79,99.81 43.59,104 | U$1.D37 43.59,104 | 43.59,104 43.6,104
RPI_D10_3V
  Bottom 0.508: Q12.2 84.83,72.47 R32.2 84.83,68.74 | 84.82,68.73 84.83,68.74 | JP2.4 92.07,65.67 87.91,65.67 84.83,68.74
RPI_D10_5V
  Bottom 0.508: Q12.3 85.69,76.2 R33.2 85.91,100.17 82.74,103.34 68.98,103.34 64.36,98.72 47.09,98.72 42.76,103.06 | U$1.D36 38.4,107.42 42.76,103.06 | 42.76,103.06
RPI_RX_3V
  Bottom 0.508: Q1.2 121.08,72.02 R10.2 121.08,68.25 121.08,68.24 122.88,66.43 126.86,66.43 JP2.32
RPI_RX_5V  (via drill 0.5)
  Top 0.508: v43.74,119.14 44.09,119.48 50.21,119.48 v52.12,117.57
  Bottom 0.508: 122.11,73.94 Q1.3 121.19,74.86 R11.2 121.19,90.61 85.55,126.25 60.72,126.25 59.28,124.82 59.28,120.7 55.78,117.19 52.5,117.19 v52.12,117.57 | U$1.D14 56.36,80.48 46.09,90.75 39.09,90.75 32.38,97.46 32.38,98.9 29.9,101.38 28.46,101.38 28.22,101.62 28.22,103.61 v43.74,119.14
RPI_TX_3V
  Bottom 0.508: Q2.2 124.59,71.89 R12.2 124.59,68.2 124.71,68.08 127.75,68.08 JP2.34
RPI_TX_5V  (via drill 0.5)
  Top 0.508: v42.83,120.05 43.55,120.77 50.74,120.77 v53.03,118.48
  Bottom 0.508: Q2.3 124.6,74.83 R13.2 124.6,89.03 86.44,127.19 59.83,127.19 58,125.36 58,121.13 55.36,118.48 v53.03,118.48 | U$1.D15 56.35,78.66 45.56,89.45 38.54,89.45 26.93,101.06 26.93,104.15 v42.83,120.05
RS
  Top 0.508: DIS1.4 165.13,85.59 144.17,85.59 141.96,87.8 95.35,87.8 90.88,92.27 81.51,92.27 74.48,99.3 68.35,99.3 66.01,96.96 66.01,92.36 U$1.D26
RX_BLU_3V
  Bottom 0.508: JP4.2 112.39,128.89 R36.2 112.49,126.61 Q14.2
RX_BLU_5V  (via drill 0.5)
  Top 0.508: v109.99,119.04 108.89,117.94 103.44,117.94 86.44,100.94 68.64,100.94 v58.16,90.45
  Bottom 0.508: Q14.3 112.99,121.03 R37.2 111.54,119.04 v109.99,119.04 | U$1.D16 v58.16,90.45
SCL  (via drill 0.35)
  Top 0.508: v108.51,55.9 108.51,55.84 v106.05,53.38 | U$1.D21 61.64,84.05 59.83,85.86 58.65,85.86 38.37,65.58 38.37,64.43 46.34,56.46 JP3.3
  Bottom 0.508: v106.05,53.38 106.65,52.77 106.65,48.91 JP1.13 106.61,46.3 47.14,46.3 46.34,47.1 JP3.3 | v108.51,55.9 108.76,56.15 137.83,56.15 138.06,56.38 139.51,56.38 184.49,11.4 196.52,11.4 198.1,9.82 U$2.SCL
SDA  (via drill 0.35, 0.5)
  Top 0.508: v86.28,47.27 86.28,46.82 87.2,45.9 106.26,45.9 106.76,46.41 106.76,48.52 107.9,49.65 107.9,50.13 JP1.14 107.93,53.48 108.77,54.32 v108.77,54.34 | U$2.SDA 195.56,5.73 194.49,4.66 186.65,4.66 184.74,6.57 184.74,9.53 v139.05,55.22 | JP3.2 43.8,51.8 47.33,48.28 v47.77,48.28 42.92,48.28 39.77,51.43 39.77,59.33 36.71,62.39 36.71,65.81 58.11,87.22 60.38,87.22 U$1.D20
  Bottom 0.508: v86.28,47.27 86.25,47.24 48.81,47.24 v47.77,48.28 | v139.05,55.22 138.17,54.34 v108.77,54.34
TX_BLU_3V
  Bottom 0.508: JP4.3 108.55,130.16 R34.2 108.73,126.56 Q13.2
TX_BLU_5V  (via drill 0.5)
  Top 0.508: v105.57,119.71 105.42,119.56 102.86,119.56 85.47,102.17 68.19,102.17 v57.63,91.61
  Bottom 0.508: Q13.3 107.03,121.91 R35.2 106.27,119.71 v105.57,119.71 | v57.63,91.61 56.54,90.52 56.54,82.11 58.19,80.46 U$1.D17

### Text on the board
tNames: Jakub Gal | V1 | 2019
bNames: V1 | 2019 | Jakub Gal